# EAGLE design RB_AQM_3_NanoGSM (EAGLE 8.0.2)
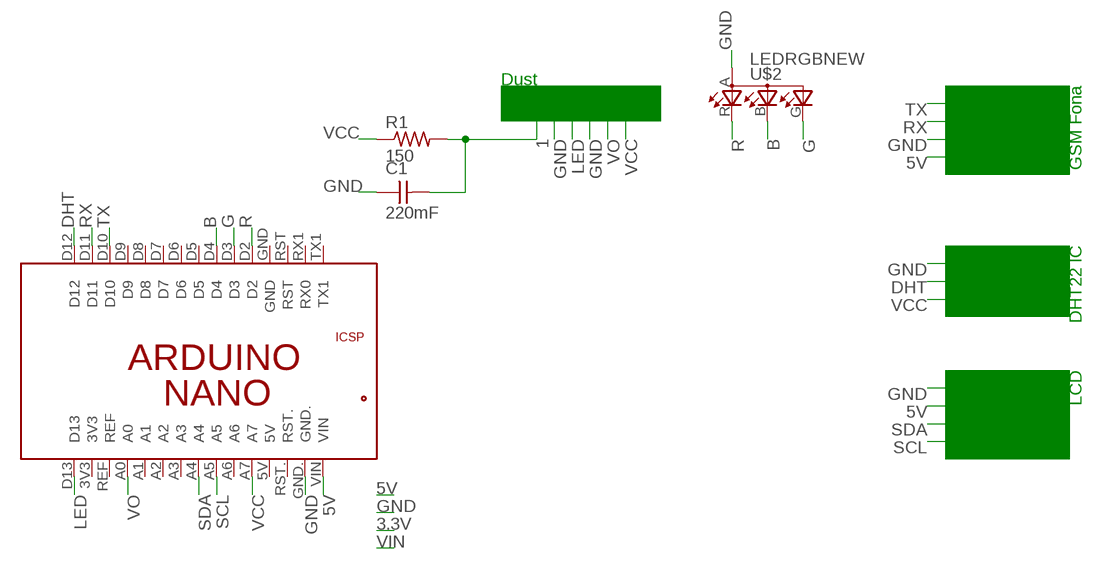
[diagram p0: schematic, sheet 1]

## Parts
C1  220mF  CAP-UNPOLARIZEDFAB  [C1206FAB]
R1  150  RES-US1206FAB  [R1206FAB]
U$2  LEDRGBNEW  [P-LCC-4]
U$3  ARD_NANO  [ARD_NANO]

## Nets
1: C1.2 R1.2
5V: U$3.VIN
B: U$2.B(CBLUE) U$3.D4
DHT: U$3.D12
G: U$2.G(CGREEN) U$3.D3
GND: C1.1 U$2.A(A2) U$3.GND.
LED: U$3.D13
R: U$2.R(CRED) U$3.D2
RX: U$3.D11
SCL: U$3.A5
SDA: U$3.A4
TX: U$3.D10
VCC: R1.1 U$3.A7
VO: U$3.A0
Unconnected: U$3.3V3 U$3.5V U$3.5V. U$3.A1 U$3.A2 U$3.A3 U$3.A6 U$3.D5 U$3.D6 U$3.D7 U$3.D8 U$3.D9 U$3.GND U$3.GND_ U$3.MISO U$3.MOSI U$3.REF U$3.RESET.. U$3.RST U$3.RST. U$3.RX1(RX0) U$3.SCK U$3.TX1

## Notes on the sheet
- Dust | GSM Fona
- DHT22 IC
- LCD

## Library data of the parts
C1 = fab:CAP-UNPOLARIZED
R1 = fab:RES-US: Resistor (US Symbol) Variants with postfix FAB are widened to allow the routing of internal traces
U$2 = fab:LEDRGBNEW
U$3 = gp:ARD_NANO

## Board
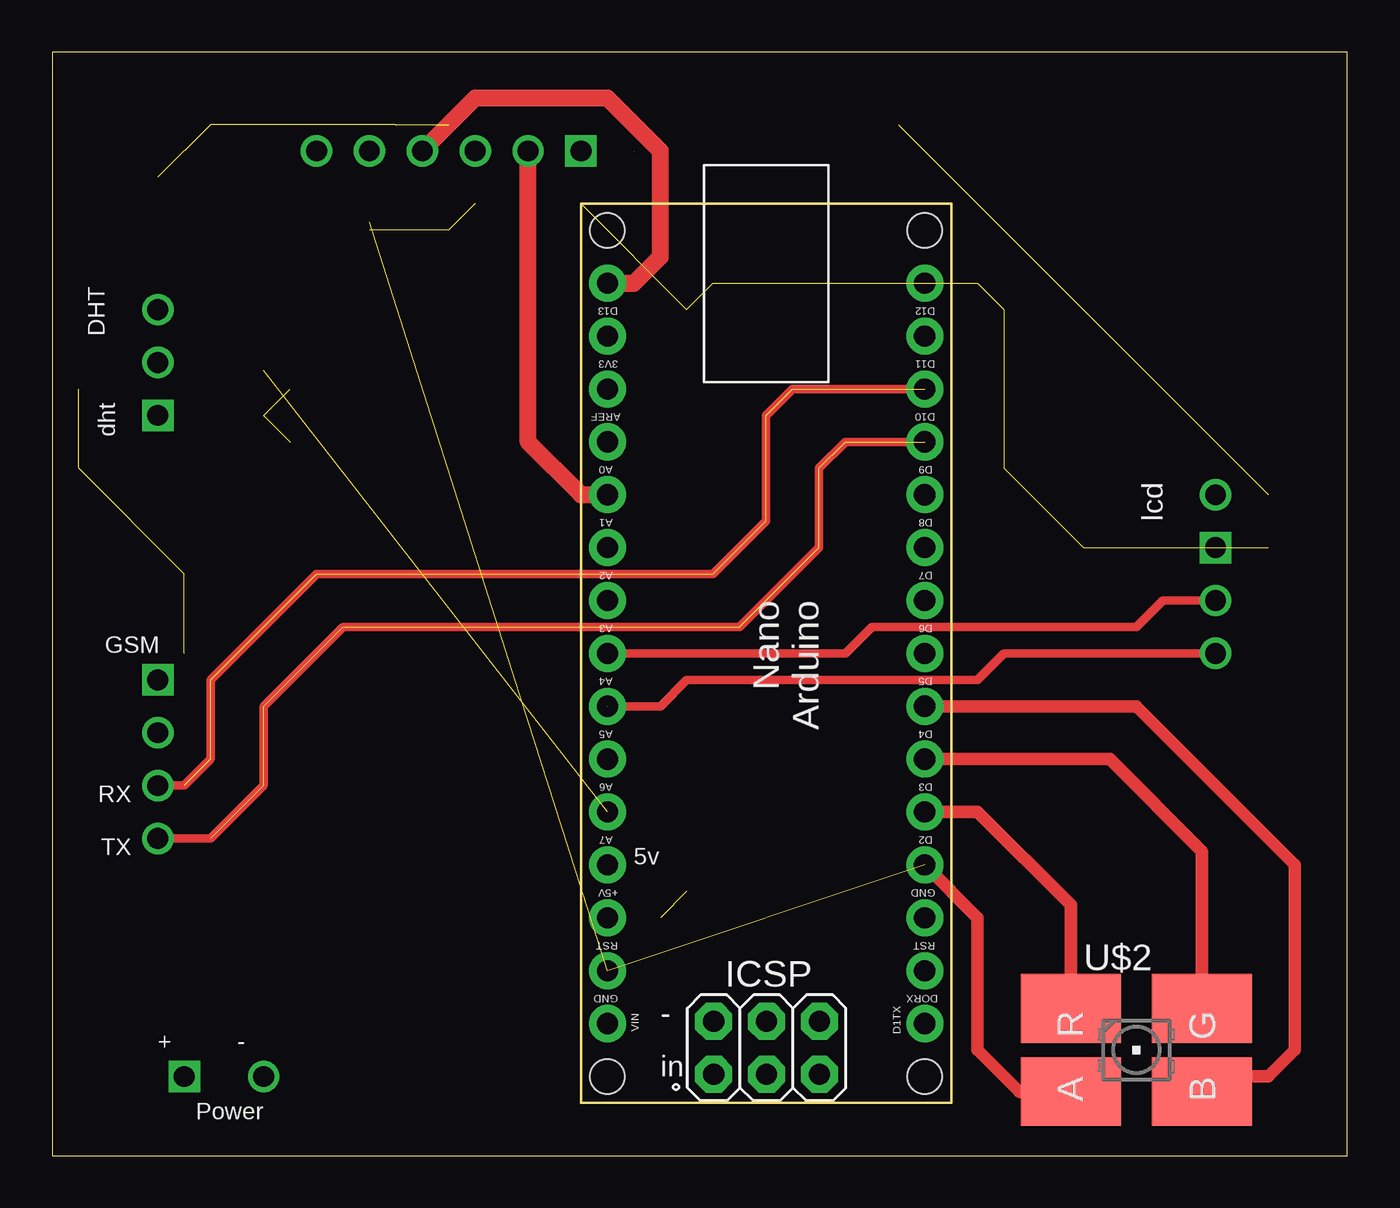
[diagram p1: board, top side]
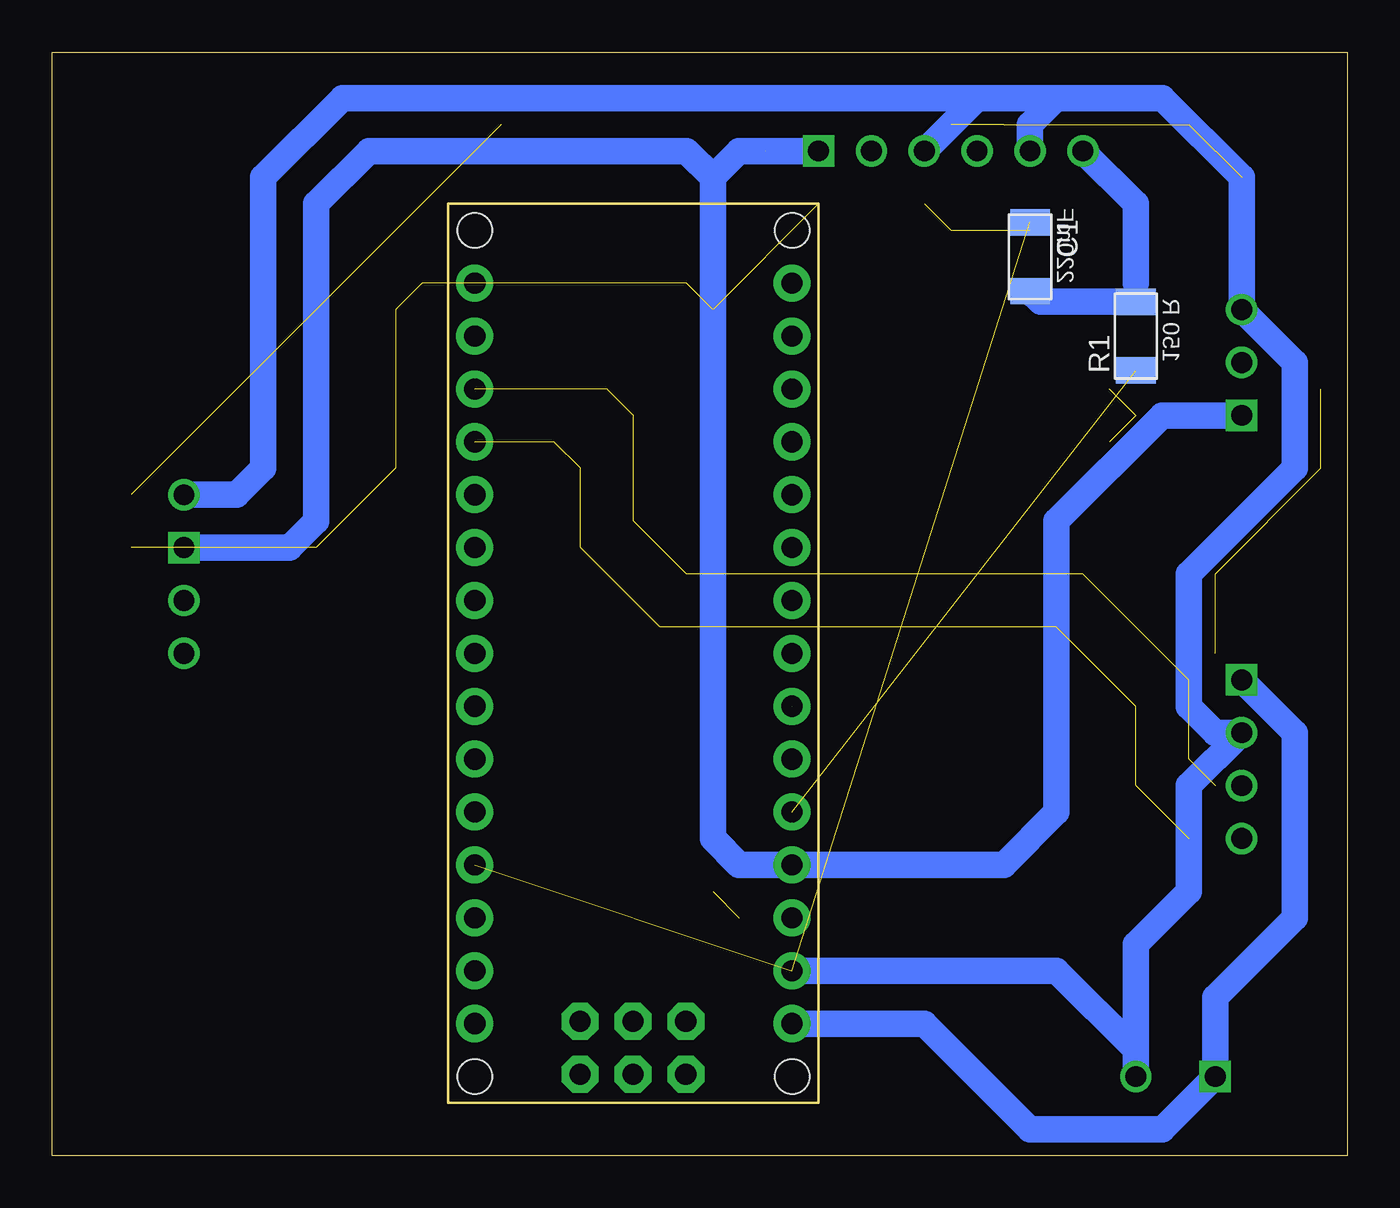
[diagram p2: board, bottom side, seen from below]

Size 62.21 x 53.01 mm. Coordinates in mm from the lower left corner, seen from the top.
Outline: 0,0 62.21,0 62.21,53.01 0,53.01 0,0
Copper layers (1*16): Top 0.035mm / dielectric 1.5mm / Bottom 0.035mm
Design rules "SparkFun": minimum track width 8mil, minimum drill 20mil, track to track 8mil, track to pad 8mil, pad to pad 8mil, via to via 8mil, smd to smd 8mil, copper to edge 8mil, drill to drill 8mil, minimum pad ring 12mil, minimum via ring 10mil, stop-mask expansion 4mil, vias tented up to drill 20mil, thermal gap 10mil

### Footprints (pad centres in the part's own frame; a part is rotated, then mirrored left to right if it is on the bottom)
C1206FAB = smd 1.27 x 1.905: 1 -1.651,0; 2 1.651,0
R1206FAB = smd 1.27 x 1.905: 1 -1.651,0; 2 1.651,0
P-LCC-4 = smd 3.3 x 4.8: A 2,-3.15; B 2,3.15; G -2,3.15; R -2,-3.15
ARD_NANO = drill 1.016 pad 1.778: 3V3 6.35,1.27; 5V 31.75,1.27; A0 11.43,1.27; A1 13.97,1.27; A2 16.51,1.27; A3 19.05,1.27; A4 21.59,1.27; A5 24.13,1.27; A6 26.67,1.27; A7 29.21,1.27; D2 29.21,16.51; D3 26.67,16.51; D4 24.13,16.51; D5 21.59,16.51; D6 19.05,16.51; D7 16.51,16.51; D8 13.97,16.51; D9 11.43,16.51; D10 8.89,16.51; D11 6.35,16.51; D12 3.81,16.51; D13 3.81,1.27; GND 31.75,16.51; GND. 36.83,1.27; REF 8.89,1.27; RST 34.29,16.51; RST. 34.29,1.27; RX1 36.83,16.51; TX1 39.37,16.51; VIN 39.37,1.27 | drill 1.016 pad 1.778 octagon: 5V. 39.268,6.375; GND_ 39.268,11.455; MISO 41.808,6.375; MOSI 39.268,8.915; RESET.. 41.808,11.455; SCK 41.808,8.915 | hole 1.651: 1.27,1.27; 1.27,16.51; 41.91,16.51; 41.91,1.27

### Placement (x,y rotation side)
C1  15.24,43.18 270 bottom
R1  10.16,39.37 90 bottom
U$2  52.07,5.08 270 top
U$3  25.4,45.72 270 top

### Tracks (layer width: path | path; a pad name or v marks a point on that pad's centre or on a via)
1
  Bottom 1.27: C1.2 14.73,41.02 R1.2
B
  Top 0.61: U$3.D4 52.07,21.59 59.69,13.97 59.69,5.08 58.42,3.81 55.95,3.81 U$2.B
G
  Top 0.61: U$2.G 55.22,14.63 50.8,19.05 U$3.D3
GND  (2 unrouted)
  Top 0.61: U$2.A 46.45,3.08 44.45,5.08 44.45,11.43 41.91,13.97
LED
  Top 0.813: U$3.D13 27.94,41.91 29.21,43.18 29.21,48.26 26.67,50.8 20.32,50.8 17.78,48.26
N$1  (7 unrouted)
N$2
  Top 0.813: 26.67,31.75 25.4,31.75 22.86,34.29 22.86,48.26
N$3  (via drill 1)
  other vias: 5.08,38.1
N$5  (2 unrouted)
N$6  (2 unrouted)
N$7  (1 unrouted)
N$8  (1 unrouted)
N$10  (8 unrouted)
N$11  (8 unrouted)
N$12  (3 unrouted)
N$18  (via drill 1)
  Bottom 1.27: 5.08,22.86 2.54,20.32 2.54,11.43 6.35,7.62 v6.35,3.81 8.89,1.27 15.24,1.27 20.32,6.35 26.67,6.35
N$19  (via drill 1)
  other vias: 5.08,22.86
N$20  (via drill 1)
  Bottom 1.27: v5.08,35.56 8.89,35.56 13.97,30.48 13.97,16.51 16.51,13.97 29.21,13.97 30.48,15.24 30.48,46.99 | 30.48,46.99 29.21,48.26 25.4,48.26 | 30.48,46.99 31.75,48.26 46.99,48.26 49.53,45.72 49.53,30.48 50.8,29.21 55.88,29.21
N$23  (via drill 1)
  Bottom 1.27: v5.08,40.64 5.08,46.99 8.89,50.8 13.97,50.8 | 13.97,50.8 15.24,49.53 15.24,48.26 | 13.97,50.8 17.78,50.8 | 17.78,50.8 20.32,48.26 | 17.78,50.8 48.26,50.8 52.07,46.99 52.07,33.02 53.34,31.75 55.88,31.75
N$24  (via drill 1)
  Bottom 1.27: 5.08,20.32 7.62,17.78 7.62,12.7 10.16,10.16 v10.16,3.81 10.16,5.08 13.97,8.89 26.67,8.89
N$25  (3 unrouted)
N$26  (via drill 1)
  Bottom 1.27: v5.08,20.32 6.35,20.32 7.62,21.59 7.62,25.4 7.62,27.94 2.54,33.02 2.54,38.1 5.08,40.64
N$27  (via drill 1)
  Top 0.406: v5.08,17.78 6.35,17.78 7.62,19.05 7.62,22.86 12.7,27.94 31.75,27.94 34.29,30.48 34.29,35.56 35.56,36.83 41.91,36.83
N$28  (via drill 1)
  Top 0.406: v5.08,15.24 7.62,15.24 10.16,17.78 10.16,21.59 13.97,25.4 33.02,25.4 36.83,29.21 36.83,33.02 38.1,34.29 41.91,34.29
N$29  (via drill 1)
  other vias: 15.24,48.26
N$30  (via drill 1)
  Bottom 1.27: v12.7,48.26 10.16,45.72 10.16,41.91
N$31  (1 unrouted)
N$32  (via drill 1)
  other vias: 25.4,48.26
N$33  (via drill 1)
  other vias: 17.78,48.26
N$34  (via drill 1)
  other vias: 20.32,48.26
N$35  (via drill 1)
  other vias: 22.86,48.26
N$36  (via drill 1)
  other vias: 55.88,31.75
N$37  (via drill 1)
  other vias: 55.88,26.67
N$38  (via drill 1)
  Top 0.406: v55.88,24.13 45.72,24.13 44.45,22.86 30.48,22.86 29.21,21.59 26.67,21.59
N$39  (via drill 1)
  other vias: 55.88,29.21
R
  Top 0.61: U$2.R 48.92,12.04 44.45,16.51 U$3.D2
SCL  (1 unrouted)
SDA
  Top 0.406: U$3.A4 38.1,24.13 39.37,25.4 52.07,25.4 53.34,26.67 55.88,26.67
VCC  (1 unrouted)

### Text on the board
tSilk: DHT | GSM
_tsilk: dht | lcd | RX | TX | 5v | - | + | - | in | Power
_bsilk: 220mF | 150 R